# Altium schematic sheet SH5 - LOAD MONITORING 1.SchDoc: Load Monitoring 1
size B; CheckedBy: Cindy Li; Engineer: Farris Matar; Organization: UW Robotics; Address1: 200 University Avenue; Address2: Waterloo; Address3: Ontario; Address4: Canada N2L 3G6; DocumentNumber: 5; Revision: 3; SheetNumber: 5; SheetTotal: 9
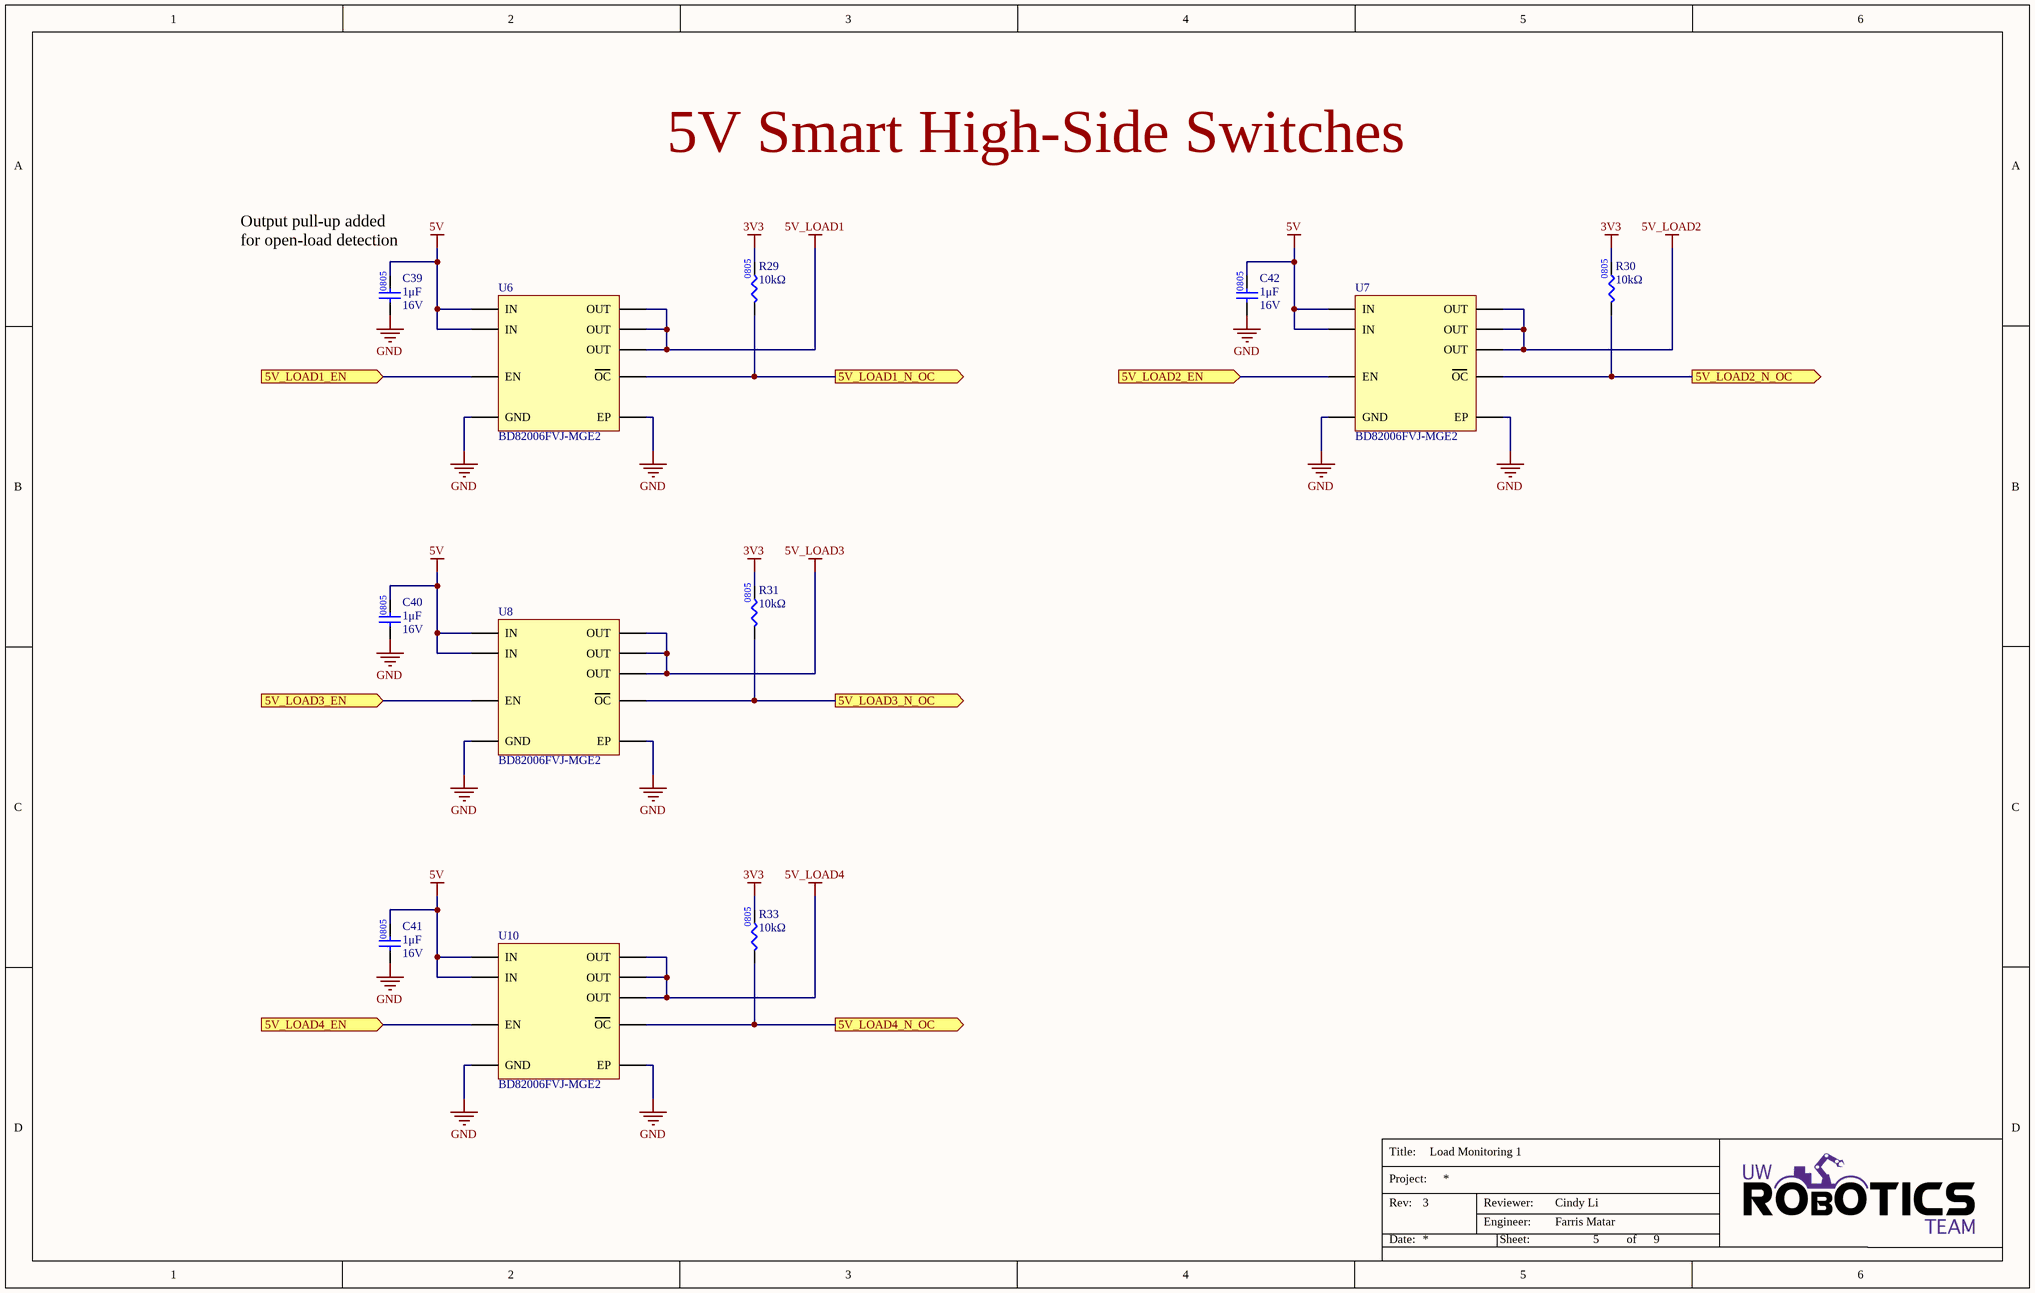
[diagram p0: SH5 - LOAD MONITORING 1.SchDoc]

## Parts
C39  value 1μF  Voltage Rating: 16V  [CAP0805]  (hidden comment: CAP_1uF_16V_0805)
C40  value 1μF  Voltage Rating: 16V  [CAP0805]  (hidden comment: CAP_1uF_16V_0805)
C41  value 1μF  Voltage Rating: 16V  [CAP0805]  (hidden comment: CAP_1uF_16V_0805)
C42  value 1μF  Voltage Rating: 16V  [CAP0805]  (hidden comment: CAP_1uF_16V_0805)
R29  value 10kΩ  [RES0805]  (hidden comment: RES_10kΩ_0805_5%)
R30  value 10kΩ  [RES0805]  (hidden comment: RES_10kΩ_0805_5%)
R31  value 10kΩ  [RES0805]  (hidden comment: RES_10kΩ_0805_5%)
R33  value 10kΩ  [RES0805]  (hidden comment: RES_10kΩ_0805_5%)
U6  BD82006FVJ-MGE2  [8-TSSOP-BJ]
U7  BD82006FVJ-MGE2  [8-TSSOP-BJ]
U8  BD82006FVJ-MGE2  [8-TSSOP-BJ]
U10  BD82006FVJ-MGE2  [8-TSSOP-BJ]

## Ports
5V_LOAD1_EN (in), 5V_LOAD1_N_OC (out), 5V_LOAD2_EN (in), 5V_LOAD2_N_OC (out), 5V_LOAD3_EN (in), 5V_LOAD3_N_OC (out), 5V_LOAD4_EN (in), 5V_LOAD4_N_OC (out)

## Nets
3V3: R29.2 R30.2 R31.2 R33.2
5V: C39.2 C40.2 C41.2 C42.2 U6.2(IN) U6.3(IN) U7.2(IN) U7.3(IN) U8.2(IN) U8.3(IN) U10.2(IN) U10.3(IN)
5V_LOAD1: U6.5(OUT) U6.6(OUT) U6.7(OUT)
5V_LOAD2: U7.5(OUT) U7.6(OUT) U7.7(OUT)
5V_LOAD3: U8.5(OUT) U8.6(OUT) U8.7(OUT)
5V_LOAD4: U10.5(OUT) U10.6(OUT) U10.7(OUT)
GND: C39.1 C40.1 C41.1 C42.1 U6.1(GND) U6.9(EP) U7.1(GND) U7.9(EP) U8.1(GND) U8.9(EP) U10.1(GND) U10.9(EP)
5V_LOAD1_EN: U6.4(EN) ; port 5V_LOAD1_EN
5V_LOAD1_N_OC: R29.1 U6.8(OC) ; port 5V_LOAD1_N_OC
5V_LOAD2_EN: U7.4(EN) ; port 5V_LOAD2_EN
5V_LOAD2_N_OC: R30.1 U7.8(OC) ; port 5V_LOAD2_N_OC
5V_LOAD3_EN: U8.4(EN) ; port 5V_LOAD3_EN
5V_LOAD3_N_OC: R31.1 U8.8(OC) ; port 5V_LOAD3_N_OC
5V_LOAD4_EN: U10.4(EN) ; port 5V_LOAD4_EN
5V_LOAD4_N_OC: R33.1 U10.8(OC) ; port 5V_LOAD4_N_OC

## Notes on the sheet
- 5V Smart High-Side Switches
- (near C39) Output pull-up added for open-load detection
- Title:
- Project:
- Date:
- Rev:
- Reviewer:
- Engineer:
- Sheet:
- of

## Library data of the parts
C39-C42 = CAP_1uF_16V_0805: CAP CER 1UF 16V X7R 0805; Manufacturer 1: Yageo; Manufacturer Part Number 1: CC0805KKX7R7BB105; Mounting Type: SMD; Supplier 1: Digi-Key; Supplier Part Number 1: 311-1365-1-ND; Package: 0805; Dielectric: X7R
R29-R31 R33 = RES_10kΩ_0805_5%: RES 10K OHM 5% 1/8W 0805; Manufacturer 1: Panasonic Electronic Components; Manufacturer Part Number 1: ERJ-6GEYJ103V; Package/Footprint: 0805; Supplier 1: Digi-Key; Supplier Part Number 1: P10KACT-ND; LCSC Part #: C17414; Mounting Type: SMD
U6-U8 U10 = BD82006FVJ-MGE2: IC PWR SWITCH N-CHAN 1:1 8TSSOP; Manufacturer 1: Rohm Semiconductor; Package/Footprint: 8-TSSOP; Rds On (Typ): 70mOhm; Mounting Type: SMD; Supplier 1: Digi-Key; Supplier Part Number 1: BD82006FVJ-MGE2CT-ND; Manufacturer Part Number 1: BD82006FVJ-MGE2